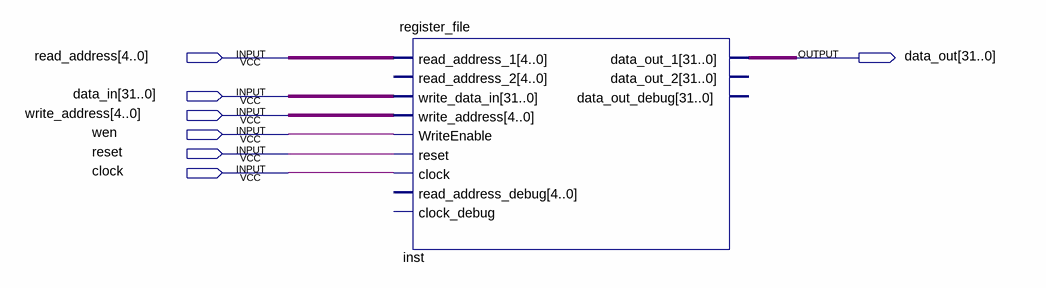
[diagram p0: schematic sheet]
// Quartus schematic reg_file_test_sim.bdf as structural Verilog: 1 symbols, 7 pins
module reg_file_test_sim (
  input  [4:0] read_address,
  input  [31:0] data_in,
  input  [4:0] write_address,
  input  wen,
  input  reset,
  input  clock,
  output [31:0] data_out
);

  register_file inst (
    .read_address_1(read_address), .write_data_in(data_in), .write_address(write_address), .WriteEnable(wen),
    .reset(reset), .clock(clock), .data_out_1(data_out));  // open: read_address_2, read_address_debug, clock_debug, data_out_2, data_out_debug
endmodule
